# EAGLE schematic ATtiny20 Study - WLCSP12 (EAGLE 7.2.0)
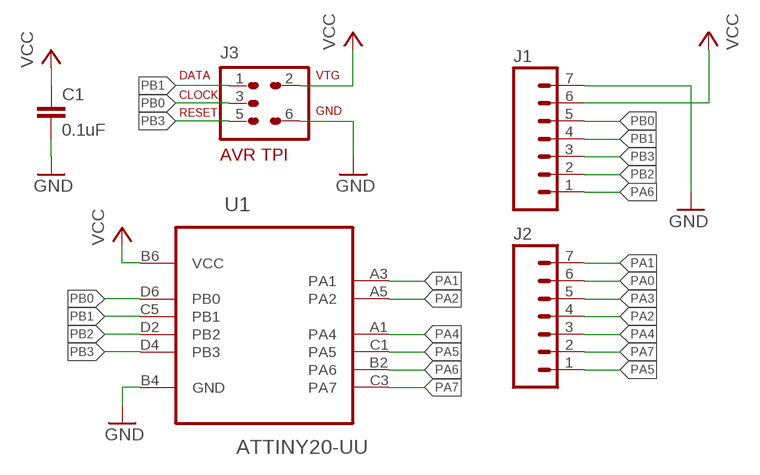
[diagram p0: schematic, sheet 1]

## Parts
C1  0.1uF  CAP0402-CAP  [0402-CAP]
J1  M07  [1X07]
J2  M07  [1X07]
J3  AVR-TPIVERT  [AVR-ISP-6]
U1  ATTINY20-UU  [12U-1]

## Nets
GND: C1.2 J1.7 J3.6 U1.B4(GND)
PA0: J2.6
PA1: J2.7 U1.A3(PA1)
PA2: J2.4 U1.A5(PA2)
PA3: J2.5
PA4: J2.3 U1.A1(PA4)
PA5: J2.1 U1.C1(PA5)
PA6: J1.1 U1.B2(PA6)
PA7: J2.2 U1.C3(PA7)
PB0: J1.5 J3.3 U1.D6(PB0)
PB1: J1.4 J3.1 U1.C5(PB1)
PB2: J1.2 U1.D2(PB2)
PB3: J1.3 J3.5 U1.D4(PB3)
VCC: C1.1 J1.6 J3.2 U1.B6(VCC)

## Library data of the parts
C1 = SparkFun-Capacitors:CAP: Capacitor Standard 0603 ceramic capacitor, and 0.1" leaded capacitor.
J1 J2 = SparkFun-Connectors:M07: Header 7 Standard 7-pin 0.1" header. Use with straight break away headers (SKU : PRT-00116), right angle break away headers (PRT-00553), swiss pins (PRT-00743), machine pins (PRT-00117), and female headers (PRT-00115). NOTES ON THE VARIANTS LOCK and LOCK_LONGPADS... This footprint was designed to help hold the alignment of a through-hole component (i.e. 7-pin header) while soldering it into place. You may notice that each hole has been shifted either up or down by 0.005 of an inch from it's more standard position (which is usually a perfectly straight line). This slight alteration caused the pins (the squares in the middle) to touch the edges of the holes. Because they are alternating, it causes a "brace" to hold the header in place. 0.005 has proven to be the perfect amount of "off-center" position when using our standard breakaway headers. Although looks a little odd when you look at the bare footprint, once you have a header in there, the alteration is very hard to notice. Also, if you push a header all the way into place, it is covered up entirely on the bottom side. This idea of altering the position of holes to aid alignment will be further integrated into the Sparkfun Library for other footprints. It can help hold any component with 3 or more connection pins.
J3 = avr-7:AVR-TPI: AVR TPI connector
U1 = Atmel_AVR8:ATTINY20-UU: 8-bit Microcontroller with Bytes In-System Programmable Flash